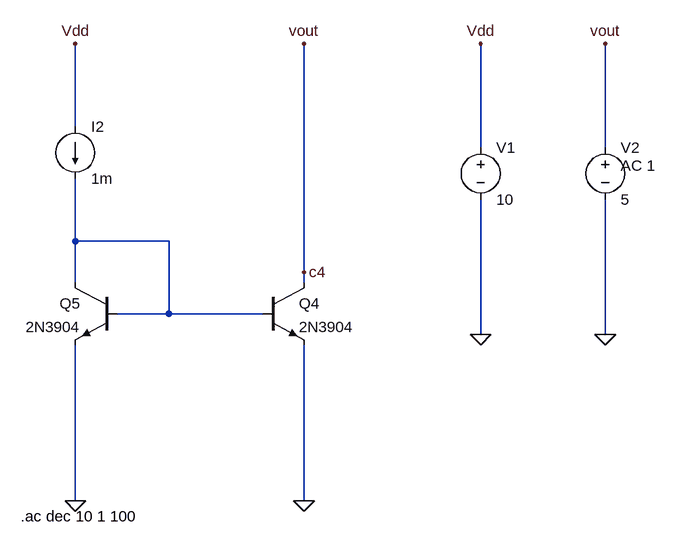
[diagram p0: schematic meros 1o (b).asc]
meros 1o (b).asc, the LTspice schematic file:
Version 4
SHEET 1 880 680
WIRE -64 -128 -64 -256
WIRE 560 -96 560 -256
WIRE 752 -96 752 -256
WIRE -64 48 -64 -48
WIRE 80 48 -64 48
WIRE 288 96 288 -256
WIRE -64 112 -64 48
WIRE 288 112 288 96
WIRE 80 160 80 48
WIRE 80 160 0 160
WIRE 224 160 80 160
WIRE 560 192 560 -16
WIRE 752 192 752 -16
WIRE -64 448 -64 208
WIRE 288 448 288 208
FLAG 288 448 0
FLAG -64 448 0
FLAG 560 192 0
FLAG 752 192 0
FLAG -64 -256 Vdd
FLAG 560 -256 Vdd
FLAG 752 -256 vout
FLAG 288 -256 vout
FLAG 288 96 c4
SYMBOL npn 224 112 R0
SYMATTR InstName Q4
SYMATTR Value 2N3904
SYMBOL npn 0 112 M0
SYMATTR InstName Q5
SYMATTR Value 2N3904
SYMBOL current -64 -128 R0
WINDOW 123 0 0 Left 0
WINDOW 39 0 0 Left 0
SYMATTR InstName I2
SYMATTR Value 1m
SYMBOL voltage 560 -112 R0
SYMATTR InstName V1
SYMATTR Value 10
SYMBOL voltage 752 -112 R0
WINDOW 123 24 44 Left 2
WINDOW 39 0 0 Left 0
SYMATTR InstName V2
SYMATTR Value 5
SYMATTR Value2 AC 1
TEXT -148 472 Left 2 !.ac dec 10 1 100

The netlist it stands for:
* meros 1o (b).asc
Q4 c4 N001 0 0 2N3904
Q5 N001 N001 0 0 2N3904
I2 Vdd N001 1m
V1 Vdd 0 10
V2 c4 0 5 AC 1
.model NPN NPN
.model PNP PNP
.lib standard.bjt
.ac dec 10 1 100
.backanno
.end